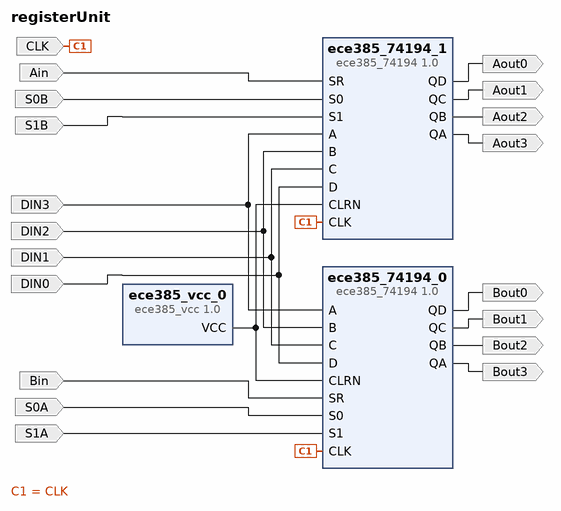
[diagram p0: block diagram of the top level]
# Vivado block design registerUnit, xc7s50csga324-1, Vivado 2022.2
create_bd_design registerUnit

create_bd_port -dir I DIN3
create_bd_port -dir I DIN2
create_bd_port -dir I DIN1
create_bd_port -dir I DIN0
create_bd_port -dir O Bout3
create_bd_port -dir O Bout2
create_bd_port -dir O Bout1
create_bd_port -dir O Bout0
create_bd_port -dir I S0A
create_bd_port -dir I S1A
create_bd_port -dir I -type clk CLK
create_bd_port -dir O Aout3
create_bd_port -dir O Aout2
create_bd_port -dir O Aout1
create_bd_port -dir O Aout0
create_bd_port -dir I S0B
create_bd_port -dir I S1B
create_bd_port -dir I Ain
create_bd_port -dir I Bin

create_bd_cell -type ip -vlnv ece.illinois.edu:ece385:ece385_74194:1.0 ece385_74194_0
create_bd_cell -type ip -vlnv ece.illinois.edu:ece385:ece385_74194:1.0 ece385_74194_1
create_bd_cell -type ip -vlnv ece.illinois.edu:ece385:ece385_vcc:1.0 ece385_vcc_0

# ---- connections ----

connect_bd_net -net A_0_1 [get_bd_ports DIN3] [get_bd_pins ece385_74194_0/A] [get_bd_pins ece385_74194_1/A]
connect_bd_net [get_bd_ports Ain] [get_bd_pins ece385_74194_1/SR]
connect_bd_net -net B_0_1 [get_bd_ports DIN2] [get_bd_pins ece385_74194_0/B] [get_bd_pins ece385_74194_1/B]
connect_bd_net [get_bd_ports Bin] [get_bd_pins ece385_74194_0/SR]
connect_bd_net -net CLK_1_1 [get_bd_ports CLK] [get_bd_pins ece385_74194_1/CLK] [get_bd_pins ece385_74194_0/CLK]
connect_bd_net -net CLRN_0_1 [get_bd_pins ece385_vcc_0/VCC] [get_bd_pins ece385_74194_0/CLRN] [get_bd_pins ece385_74194_1/CLRN]
connect_bd_net -net C_0_1 [get_bd_ports DIN1] [get_bd_pins ece385_74194_0/C] [get_bd_pins ece385_74194_1/C]
connect_bd_net -net D_0_1 [get_bd_ports DIN0] [get_bd_pins ece385_74194_0/D] [get_bd_pins ece385_74194_1/D]
connect_bd_net -net S0_0_1 [get_bd_ports S0A] [get_bd_pins ece385_74194_0/S0]
connect_bd_net -net S0_1_1 [get_bd_ports S0B] [get_bd_pins ece385_74194_1/S0]
connect_bd_net -net S1_0_1 [get_bd_ports S1A] [get_bd_pins ece385_74194_0/S1]
connect_bd_net -net S1_1_1 [get_bd_ports S1B] [get_bd_pins ece385_74194_1/S1]
connect_bd_net [get_bd_pins ece385_74194_0/QA] [get_bd_ports Bout3]
connect_bd_net [get_bd_pins ece385_74194_0/QB] [get_bd_ports Bout2]
connect_bd_net [get_bd_pins ece385_74194_0/QC] [get_bd_ports Bout1]
connect_bd_net [get_bd_pins ece385_74194_0/QD] [get_bd_ports Bout0]
connect_bd_net [get_bd_pins ece385_74194_1/QA] [get_bd_ports Aout3]
connect_bd_net [get_bd_pins ece385_74194_1/QB] [get_bd_ports Aout2]
connect_bd_net [get_bd_pins ece385_74194_1/QC] [get_bd_ports Aout1]
connect_bd_net [get_bd_pins ece385_74194_1/QD] [get_bd_ports Aout0]

validate_bd_design
save_bd_design
